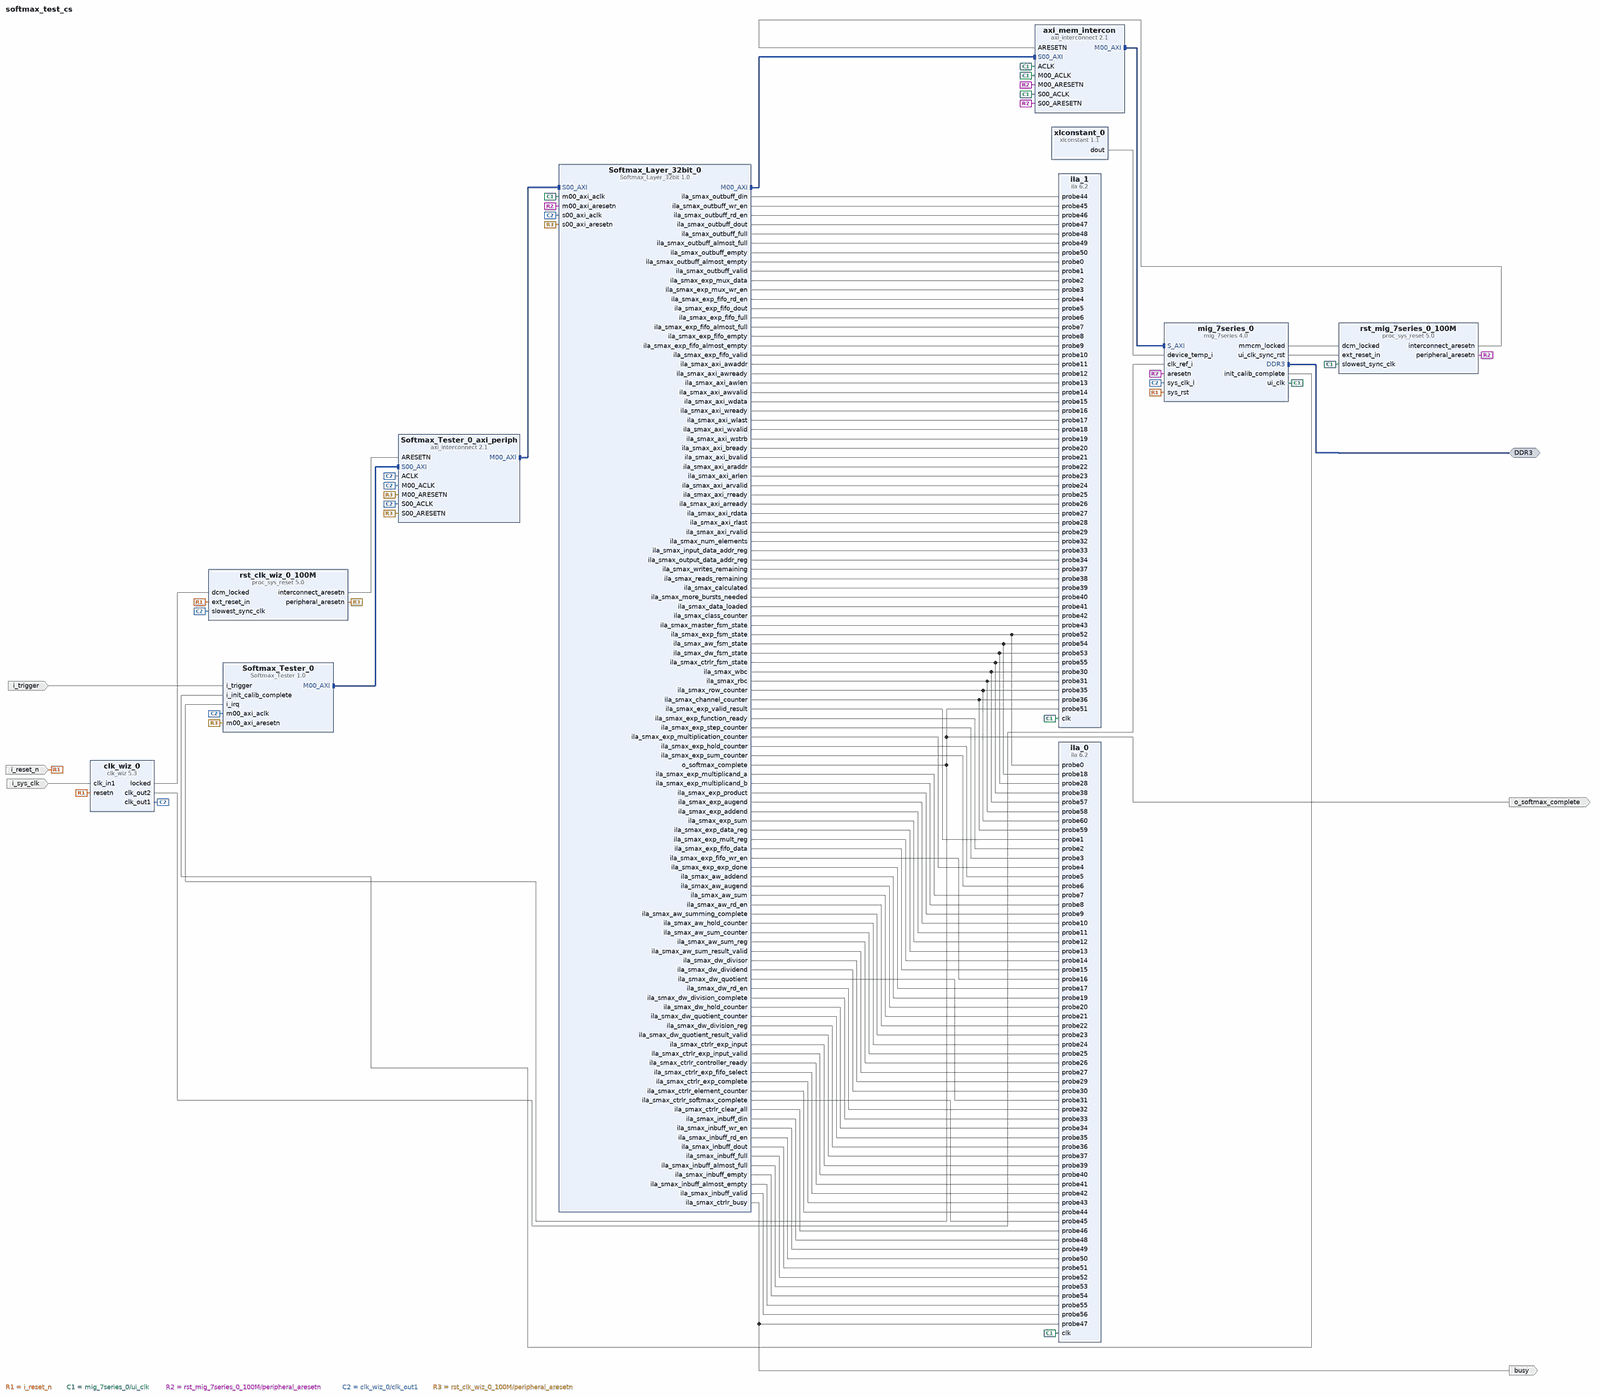
[diagram p0: block diagram of the top level, whole]
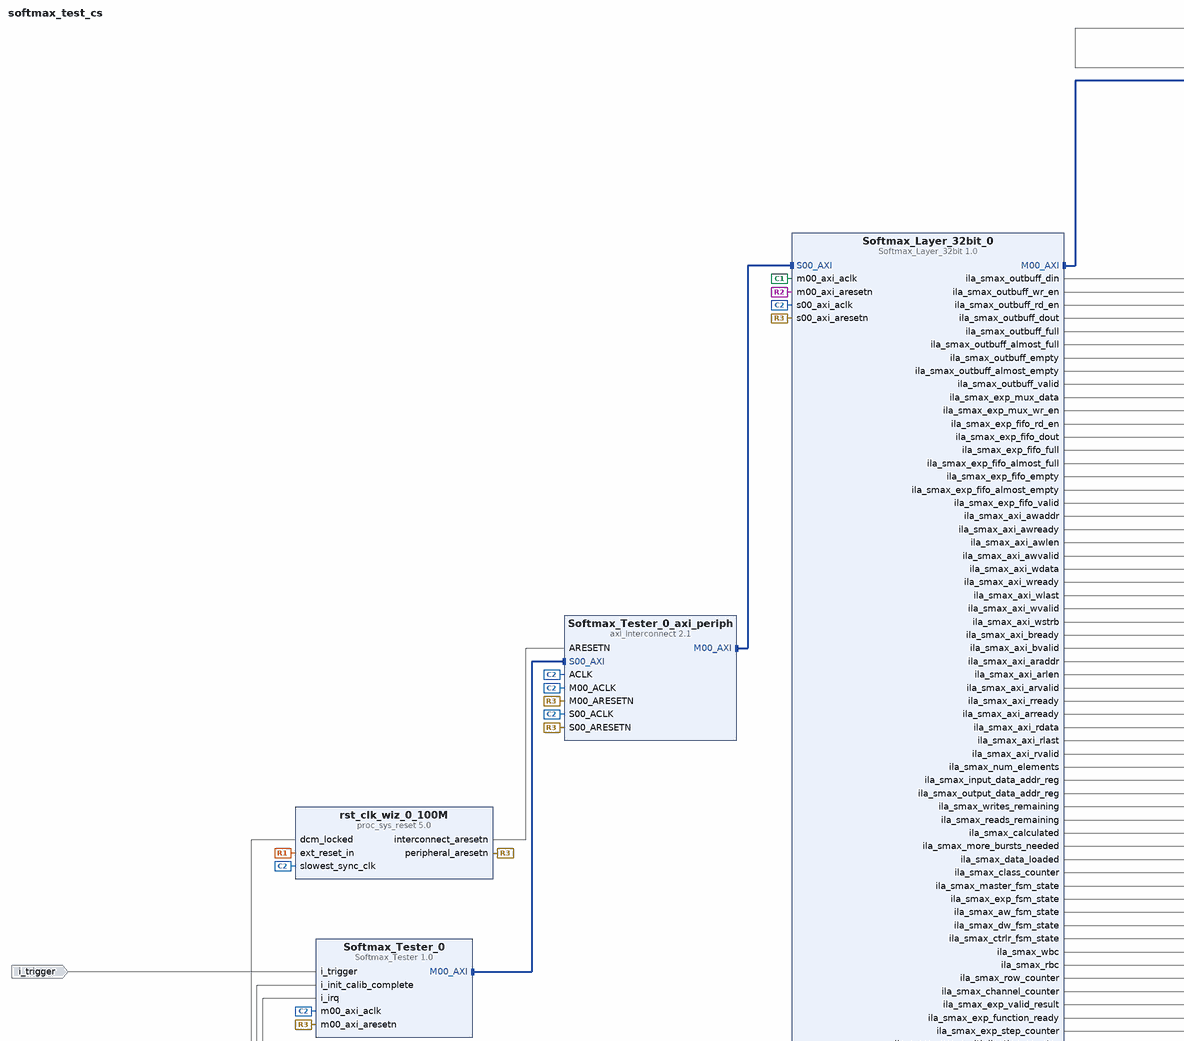
[diagram p1: block diagram of the top level, upper left part]
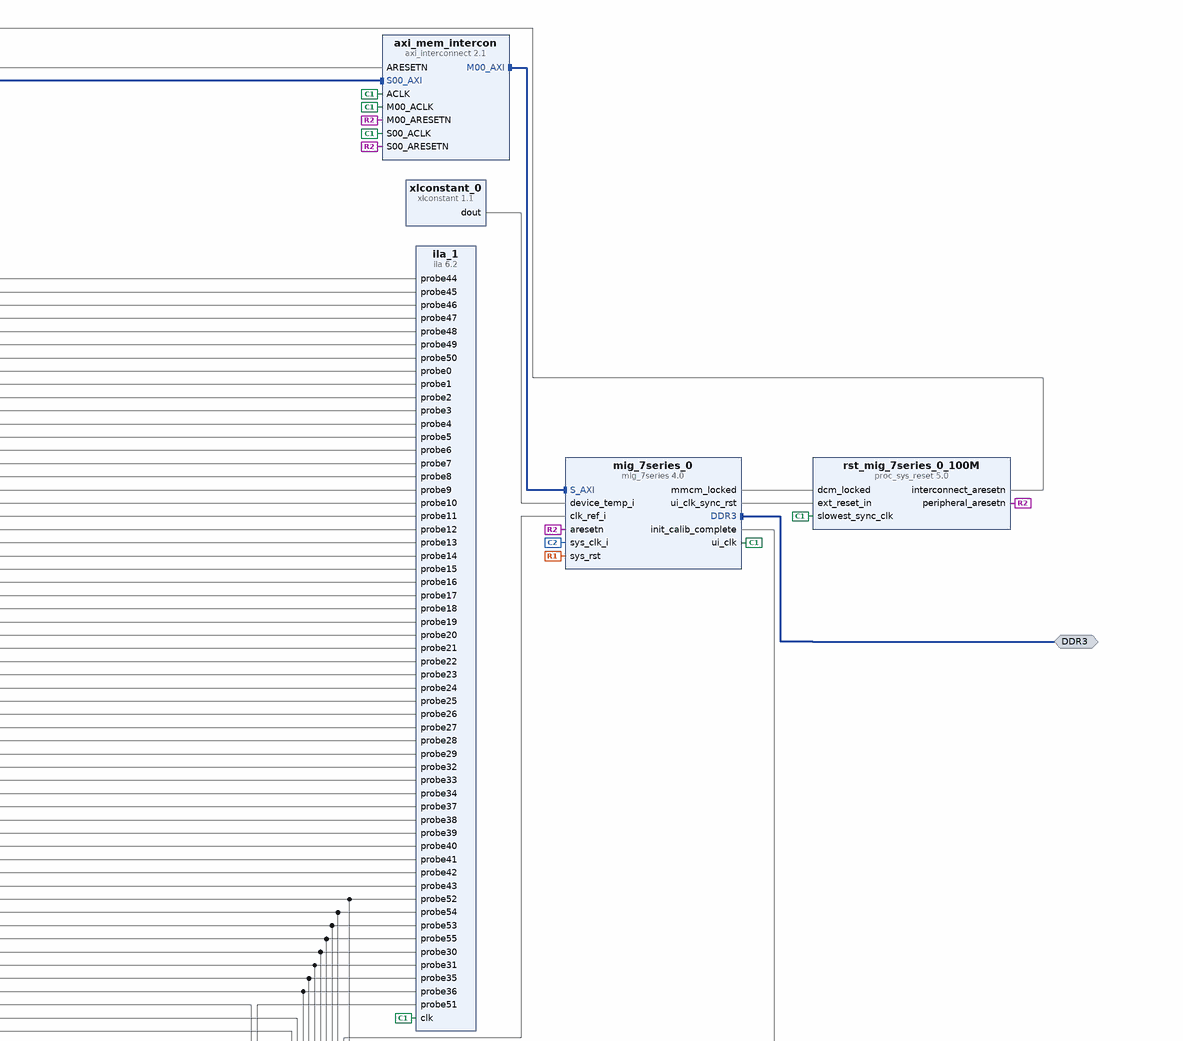
[diagram p2: block diagram of the top level, upper right part]
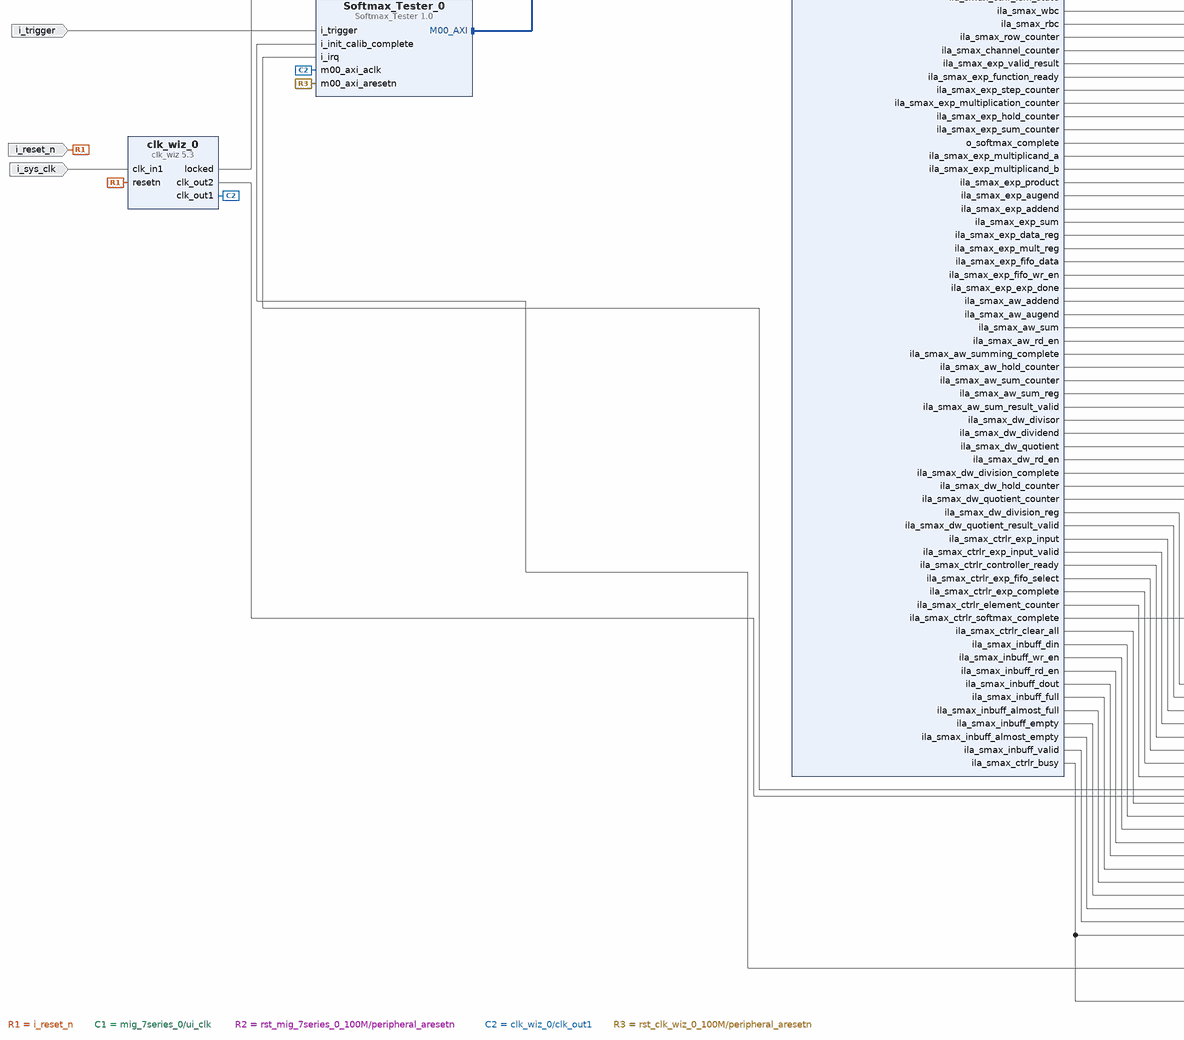
[diagram p3: block diagram of the top level, lower left part]
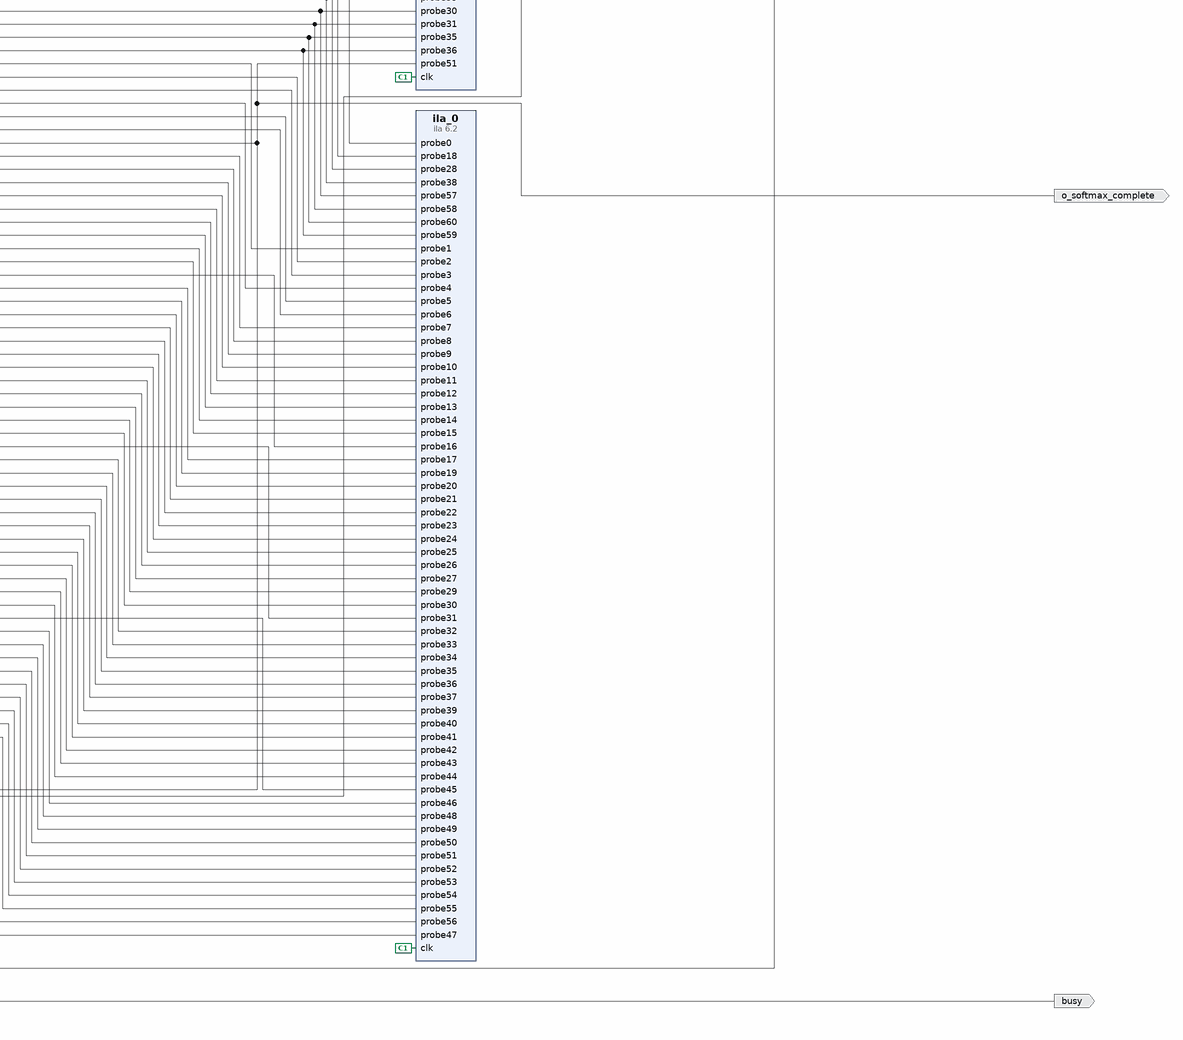
[diagram p4: block diagram of the top level, lower right part]
# Vivado block design softmax_test_cs, xc7a200tsbg484-1, Vivado 2016.4
create_bd_design softmax_test_cs

create_bd_intf_port -mode Master -vlnv xilinx.com:interface:ddrx_rtl:1.0 DDR3
create_bd_port -dir I -type clk i_sys_clk
create_bd_port -dir I -type rst i_reset_n
set_property -dict {CONFIG.POLARITY ACTIVE_LOW} [get_bd_ports i_reset_n]
create_bd_port -dir O o_softmax_complete
create_bd_port -dir I i_trigger
create_bd_port -dir O busy

create_bd_cell -type ip -vlnv xilinx.com:ip:mig_7series:4.0 mig_7series_0
set_property -dict [list \
  CONFIG.XML_INPUT_FILE mig_a.prj \
  CONFIG.RESET_BOARD_INTERFACE Custom \
  CONFIG.BOARD_MIG_PARAM Custom \
] [get_bd_cells mig_7series_0]
create_bd_cell -type ip -vlnv xilinx.com:ip:clk_wiz:5.3 clk_wiz_0
set_property -dict [list \
  CONFIG.CLKOUT2_USED true \
  CONFIG.NUM_OUT_CLKS 2 \
  CONFIG.CLKOUT2_REQUESTED_OUT_FREQ 200.000 \
  CONFIG.RESET_PORT resetn \
  CONFIG.MMCM_DIVCLK_DIVIDE 1 \
  CONFIG.MMCM_CLKOUT1_DIVIDE 5 \
  CONFIG.RESET_TYPE ACTIVE_LOW \
  CONFIG.CLKOUT2_JITTER 114.829 \
  CONFIG.CLKOUT2_PHASE_ERROR 98.575 \
] [get_bd_cells clk_wiz_0]
create_bd_cell -type ip -vlnv xilinx.com:ip:axi_interconnect:2.1 axi_mem_intercon
set_property -dict {CONFIG.NUM_MI 1} [get_bd_cells axi_mem_intercon]
create_bd_cell -type ip -vlnv xilinx.com:ip:proc_sys_reset:5.0 rst_mig_7series_0_100M
create_bd_cell -type ip -vlnv xilinx.com:ip:axi_interconnect:2.1 Softmax_Tester_0_axi_periph
set_property -dict {CONFIG.NUM_MI 1} [get_bd_cells Softmax_Tester_0_axi_periph]
create_bd_cell -type ip -vlnv xilinx.com:ip:proc_sys_reset:5.0 rst_clk_wiz_0_100M
create_bd_cell -type ip -vlnv xilinx.com:ip:xlconstant:1.1 xlconstant_0
set_property -dict {CONFIG.CONST_WIDTH 12} [get_bd_cells xlconstant_0]
create_bd_cell -type ip -vlnv xilinx.com:ip:ila:6.2 ila_0
set_property -dict [list \
  CONFIG.C_PROBE60_WIDTH 8 \
  CONFIG.C_PROBE59_WIDTH 16 \
  CONFIG.C_PROBE58_WIDTH 8 \
  CONFIG.C_PROBE57_WIDTH 8 \
  CONFIG.C_PROBE51_WIDTH 32 \
  CONFIG.C_PROBE48_WIDTH 32 \
  CONFIG.C_PROBE44_WIDTH 16 \
  CONFIG.C_PROBE39_WIDTH 32 \
  CONFIG.C_PROBE38_WIDTH 14 \
  CONFIG.C_PROBE36_WIDTH 32 \
  CONFIG.C_PROBE35_WIDTH 16 \
  CONFIG.C_PROBE34_WIDTH 8 \
  CONFIG.C_PROBE31_WIDTH 32 \
  CONFIG.C_PROBE30_WIDTH 32 \
  CONFIG.C_PROBE29_WIDTH 32 \
  CONFIG.C_PROBE28_WIDTH 4 \
  CONFIG.C_PROBE26_WIDTH 32 \
  CONFIG.C_PROBE25_WIDTH 16 \
  CONFIG.C_PROBE24_WIDTH 8 \
  CONFIG.C_PROBE21_WIDTH 32 \
  CONFIG.C_PROBE20_WIDTH 32 \
  CONFIG.C_PROBE19_WIDTH 32 \
  CONFIG.C_PROBE18_WIDTH 4 \
  CONFIG.C_PROBE15_WIDTH 32 \
  CONFIG.C_PROBE14_WIDTH 32 \
  CONFIG.C_PROBE13_WIDTH 32 \
  CONFIG.C_PROBE12_WIDTH 32 \
  CONFIG.C_PROBE11_WIDTH 32 \
  CONFIG.C_PROBE10_WIDTH 32 \
  CONFIG.C_PROBE9_WIDTH 32 \
  CONFIG.C_PROBE8_WIDTH 32 \
  CONFIG.C_PROBE7_WIDTH 32 \
  CONFIG.C_PROBE6_WIDTH 8 \
  CONFIG.C_PROBE5_WIDTH 8 \
  CONFIG.C_PROBE4_WIDTH 8 \
  CONFIG.C_PROBE3_WIDTH 8 \
  CONFIG.C_PROBE0_WIDTH 4 \
  CONFIG.C_NUM_OF_PROBES 61 \
  CONFIG.C_ENABLE_ILA_AXI_MON false \
  CONFIG.C_MONITOR_TYPE Native \
] [get_bd_cells ila_0]
create_bd_cell -type ip -vlnv xilinx.com:ip:ila:6.2 ila_1
set_property -dict [list \
  CONFIG.C_PROBE55_WIDTH 4 \
  CONFIG.C_PROBE54_WIDTH 4 \
  CONFIG.C_PROBE53_WIDTH 4 \
  CONFIG.C_PROBE52_WIDTH 4 \
  CONFIG.C_PROBE47_WIDTH 32 \
  CONFIG.C_PROBE44_WIDTH 32 \
  CONFIG.C_PROBE43_WIDTH 4 \
  CONFIG.C_PROBE42_WIDTH 32 \
  CONFIG.C_PROBE38_WIDTH 16 \
  CONFIG.C_PROBE37_WIDTH 16 \
  CONFIG.C_PROBE36_WIDTH 16 \
  CONFIG.C_PROBE35_WIDTH 8 \
  CONFIG.C_PROBE34_WIDTH 32 \
  CONFIG.C_PROBE33_WIDTH 32 \
  CONFIG.C_PROBE32_WIDTH 16 \
  CONFIG.C_PROBE31_WIDTH 8 \
  CONFIG.C_PROBE30_WIDTH 8 \
  CONFIG.C_PROBE27_WIDTH 32 \
  CONFIG.C_PROBE23_WIDTH 8 \
  CONFIG.C_PROBE22_WIDTH 32 \
  CONFIG.C_PROBE19_WIDTH 4 \
  CONFIG.C_PROBE15_WIDTH 32 \
  CONFIG.C_PROBE13_WIDTH 8 \
  CONFIG.C_PROBE11_WIDTH 32 \
  CONFIG.C_PROBE5_WIDTH 32 \
  CONFIG.C_PROBE2_WIDTH 32 \
  CONFIG.C_NUM_OF_PROBES 56 \
  CONFIG.C_ENABLE_ILA_AXI_MON false \
  CONFIG.C_MONITOR_TYPE Native \
] [get_bd_cells ila_1]
create_bd_cell -type ip -vlnv xilinx.com:user:Softmax_Tester:1.0 Softmax_Tester_0
create_bd_cell -type ip -vlnv xilinx.com:user:Softmax_Layer_32bit:1.0 Softmax_Layer_32bit_0

# ---- connections ----

connect_bd_intf_net [get_bd_intf_pins Softmax_Layer_32bit_0/M00_AXI] [get_bd_intf_pins axi_mem_intercon/S00_AXI]
connect_bd_intf_net [get_bd_intf_pins axi_mem_intercon/M00_AXI] [get_bd_intf_pins mig_7series_0/S_AXI]
connect_bd_intf_net [get_bd_intf_pins Softmax_Tester_0/M00_AXI] [get_bd_intf_pins Softmax_Tester_0_axi_periph/S00_AXI]
connect_bd_intf_net [get_bd_intf_pins Softmax_Tester_0_axi_periph/M00_AXI] [get_bd_intf_pins Softmax_Layer_32bit_0/S00_AXI]
connect_bd_intf_net [get_bd_intf_ports DDR3] [get_bd_intf_pins mig_7series_0/DDR3]
connect_bd_net -net clk_in1_1 [get_bd_ports i_sys_clk] [get_bd_pins clk_wiz_0/clk_in1]
connect_bd_net -net reset_1 [get_bd_ports i_reset_n] \
  [get_bd_pins rst_clk_wiz_0_100M/ext_reset_in] [get_bd_pins mig_7series_0/sys_rst] [get_bd_pins clk_wiz_0/resetn]
connect_bd_net [get_bd_pins mig_7series_0/ui_clk] \
  [get_bd_pins rst_mig_7series_0_100M/slowest_sync_clk] [get_bd_pins ila_0/clk] [get_bd_pins ila_1/clk] \
  [get_bd_pins axi_mem_intercon/S00_ACLK] [get_bd_pins axi_mem_intercon/ACLK] [get_bd_pins axi_mem_intercon/M00_ACLK] \
  [get_bd_pins Softmax_Layer_32bit_0/m00_axi_aclk]
connect_bd_net [get_bd_pins mig_7series_0/mmcm_locked] [get_bd_pins rst_mig_7series_0_100M/dcm_locked]
connect_bd_net [get_bd_pins mig_7series_0/ui_clk_sync_rst] [get_bd_pins rst_mig_7series_0_100M/ext_reset_in]
connect_bd_net [get_bd_pins rst_mig_7series_0_100M/peripheral_aresetn] \
  [get_bd_pins mig_7series_0/aresetn] [get_bd_pins axi_mem_intercon/S00_ARESETN] [get_bd_pins axi_mem_intercon/M00_ARESETN] \
  [get_bd_pins Softmax_Layer_32bit_0/m00_axi_aresetn]
connect_bd_net [get_bd_pins rst_mig_7series_0_100M/interconnect_aresetn] [get_bd_pins axi_mem_intercon/ARESETN]
connect_bd_net [get_bd_pins clk_wiz_0/clk_out1] \
  [get_bd_pins rst_clk_wiz_0_100M/slowest_sync_clk] [get_bd_pins mig_7series_0/sys_clk_i] \
  [get_bd_pins Softmax_Tester_0/m00_axi_aclk] [get_bd_pins Softmax_Tester_0_axi_periph/S00_ACLK] \
  [get_bd_pins Softmax_Tester_0_axi_periph/ACLK] [get_bd_pins Softmax_Tester_0_axi_periph/M00_ACLK] \
  [get_bd_pins Softmax_Layer_32bit_0/s00_axi_aclk]
connect_bd_net [get_bd_pins clk_wiz_0/locked] [get_bd_pins rst_clk_wiz_0_100M/dcm_locked]
connect_bd_net [get_bd_pins rst_clk_wiz_0_100M/peripheral_aresetn] \
  [get_bd_pins Softmax_Tester_0/m00_axi_aresetn] [get_bd_pins Softmax_Tester_0_axi_periph/S00_ARESETN] \
  [get_bd_pins Softmax_Tester_0_axi_periph/M00_ARESETN] [get_bd_pins Softmax_Layer_32bit_0/s00_axi_aresetn]
connect_bd_net [get_bd_pins rst_clk_wiz_0_100M/interconnect_aresetn] [get_bd_pins Softmax_Tester_0_axi_periph/ARESETN]
connect_bd_net [get_bd_pins mig_7series_0/init_calib_complete] [get_bd_pins Softmax_Tester_0/i_init_calib_complete]
connect_bd_net [get_bd_pins Softmax_Layer_32bit_0/o_softmax_complete] \
  [get_bd_ports o_softmax_complete] [get_bd_pins ila_1/probe51] [get_bd_pins Softmax_Tester_0/i_irq]
connect_bd_net [get_bd_pins xlconstant_0/dout] [get_bd_pins mig_7series_0/device_temp_i]
connect_bd_net [get_bd_pins clk_wiz_0/clk_out2] [get_bd_pins mig_7series_0/clk_ref_i]
connect_bd_net [get_bd_ports i_trigger] [get_bd_pins Softmax_Tester_0/i_trigger]
connect_bd_net [get_bd_pins Softmax_Layer_32bit_0/ila_smax_exp_fsm_state] [get_bd_pins ila_0/probe0] [get_bd_pins ila_1/probe52]
connect_bd_net [get_bd_pins Softmax_Layer_32bit_0/ila_smax_exp_valid_result] [get_bd_pins ila_0/probe1]
connect_bd_net [get_bd_pins Softmax_Layer_32bit_0/ila_smax_exp_function_ready] [get_bd_pins ila_0/probe2]
connect_bd_net [get_bd_pins Softmax_Layer_32bit_0/ila_smax_exp_step_counter] [get_bd_pins ila_0/probe3]
connect_bd_net [get_bd_pins Softmax_Layer_32bit_0/ila_smax_exp_multiplication_counter] [get_bd_pins ila_0/probe4]
connect_bd_net [get_bd_pins Softmax_Layer_32bit_0/ila_smax_exp_hold_counter] [get_bd_pins ila_0/probe5]
connect_bd_net [get_bd_pins Softmax_Layer_32bit_0/ila_smax_exp_sum_counter] [get_bd_pins ila_0/probe6]
connect_bd_net [get_bd_pins Softmax_Layer_32bit_0/ila_smax_exp_multiplicand_a] [get_bd_pins ila_0/probe7]
connect_bd_net [get_bd_pins Softmax_Layer_32bit_0/ila_smax_exp_multiplicand_b] [get_bd_pins ila_0/probe8]
connect_bd_net [get_bd_pins Softmax_Layer_32bit_0/ila_smax_exp_product] [get_bd_pins ila_0/probe9]
connect_bd_net [get_bd_pins Softmax_Layer_32bit_0/ila_smax_exp_augend] [get_bd_pins ila_0/probe10]
connect_bd_net [get_bd_pins Softmax_Layer_32bit_0/ila_smax_exp_addend] [get_bd_pins ila_0/probe11]
connect_bd_net [get_bd_pins Softmax_Layer_32bit_0/ila_smax_exp_sum] [get_bd_pins ila_0/probe12]
connect_bd_net [get_bd_pins Softmax_Layer_32bit_0/ila_smax_exp_data_reg] [get_bd_pins ila_0/probe13]
connect_bd_net [get_bd_pins Softmax_Layer_32bit_0/ila_smax_exp_mult_reg] [get_bd_pins ila_0/probe14]
connect_bd_net [get_bd_pins Softmax_Layer_32bit_0/ila_smax_exp_fifo_data] [get_bd_pins ila_0/probe15]
connect_bd_net [get_bd_pins Softmax_Layer_32bit_0/ila_smax_exp_fifo_wr_en] [get_bd_pins ila_0/probe16]
connect_bd_net [get_bd_pins Softmax_Layer_32bit_0/ila_smax_exp_exp_done] [get_bd_pins ila_0/probe17]
connect_bd_net [get_bd_pins Softmax_Layer_32bit_0/ila_smax_aw_fsm_state] [get_bd_pins ila_0/probe18] [get_bd_pins ila_1/probe54]
connect_bd_net [get_bd_pins Softmax_Layer_32bit_0/ila_smax_aw_addend] [get_bd_pins ila_0/probe19]
connect_bd_net [get_bd_pins Softmax_Layer_32bit_0/ila_smax_aw_augend] [get_bd_pins ila_0/probe20]
connect_bd_net [get_bd_pins Softmax_Layer_32bit_0/ila_smax_aw_sum] [get_bd_pins ila_0/probe21]
connect_bd_net [get_bd_pins Softmax_Layer_32bit_0/ila_smax_aw_rd_en] [get_bd_pins ila_0/probe22]
connect_bd_net [get_bd_pins Softmax_Layer_32bit_0/ila_smax_aw_summing_complete] [get_bd_pins ila_0/probe23]
connect_bd_net [get_bd_pins Softmax_Layer_32bit_0/ila_smax_aw_hold_counter] [get_bd_pins ila_0/probe24]
connect_bd_net [get_bd_pins Softmax_Layer_32bit_0/ila_smax_aw_sum_counter] [get_bd_pins ila_0/probe25]
connect_bd_net [get_bd_pins Softmax_Layer_32bit_0/ila_smax_aw_sum_reg] [get_bd_pins ila_0/probe26]
connect_bd_net [get_bd_pins Softmax_Layer_32bit_0/ila_smax_aw_sum_result_valid] [get_bd_pins ila_0/probe27]
connect_bd_net [get_bd_pins Softmax_Layer_32bit_0/ila_smax_dw_fsm_state] [get_bd_pins ila_0/probe28] [get_bd_pins ila_1/probe53]
connect_bd_net [get_bd_pins Softmax_Layer_32bit_0/ila_smax_dw_divisor] [get_bd_pins ila_0/probe29]
connect_bd_net [get_bd_pins Softmax_Layer_32bit_0/ila_smax_dw_dividend] [get_bd_pins ila_0/probe30]
connect_bd_net [get_bd_pins Softmax_Layer_32bit_0/ila_smax_dw_quotient] [get_bd_pins ila_0/probe31]
connect_bd_net [get_bd_pins Softmax_Layer_32bit_0/ila_smax_dw_rd_en] [get_bd_pins ila_0/probe32]
connect_bd_net [get_bd_pins Softmax_Layer_32bit_0/ila_smax_dw_division_complete] [get_bd_pins ila_0/probe33]
connect_bd_net [get_bd_pins Softmax_Layer_32bit_0/ila_smax_dw_hold_counter] [get_bd_pins ila_0/probe34]
connect_bd_net [get_bd_pins Softmax_Layer_32bit_0/ila_smax_dw_quotient_counter] [get_bd_pins ila_0/probe35]
connect_bd_net [get_bd_pins Softmax_Layer_32bit_0/ila_smax_dw_division_reg] [get_bd_pins ila_0/probe36]
connect_bd_net [get_bd_pins Softmax_Layer_32bit_0/ila_smax_dw_quotient_result_valid] [get_bd_pins ila_0/probe37]
connect_bd_net [get_bd_pins Softmax_Layer_32bit_0/ila_smax_ctrlr_fsm_state] [get_bd_pins ila_0/probe38] [get_bd_pins ila_1/probe55]
connect_bd_net [get_bd_pins Softmax_Layer_32bit_0/ila_smax_ctrlr_exp_input] [get_bd_pins ila_0/probe39]
connect_bd_net [get_bd_pins Softmax_Layer_32bit_0/ila_smax_ctrlr_exp_input_valid] [get_bd_pins ila_0/probe40]
connect_bd_net [get_bd_pins Softmax_Layer_32bit_0/ila_smax_ctrlr_controller_ready] [get_bd_pins ila_0/probe41]
connect_bd_net [get_bd_pins Softmax_Layer_32bit_0/ila_smax_ctrlr_exp_fifo_select] [get_bd_pins ila_0/probe42]
connect_bd_net [get_bd_pins Softmax_Layer_32bit_0/ila_smax_ctrlr_exp_complete] [get_bd_pins ila_0/probe43]
connect_bd_net [get_bd_pins Softmax_Layer_32bit_0/ila_smax_ctrlr_element_counter] [get_bd_pins ila_0/probe44]
connect_bd_net [get_bd_pins Softmax_Layer_32bit_0/ila_smax_ctrlr_softmax_complete] [get_bd_pins ila_0/probe45]
connect_bd_net [get_bd_pins Softmax_Layer_32bit_0/ila_smax_ctrlr_clear_all] [get_bd_pins ila_0/probe46]
connect_bd_net [get_bd_pins Softmax_Layer_32bit_0/ila_smax_ctrlr_busy] [get_bd_ports busy] [get_bd_pins ila_0/probe47]
connect_bd_net [get_bd_pins Softmax_Layer_32bit_0/ila_smax_inbuff_din] [get_bd_pins ila_0/probe48]
connect_bd_net [get_bd_pins Softmax_Layer_32bit_0/ila_smax_inbuff_wr_en] [get_bd_pins ila_0/probe49]
connect_bd_net [get_bd_pins Softmax_Layer_32bit_0/ila_smax_inbuff_rd_en] [get_bd_pins ila_0/probe50]
connect_bd_net [get_bd_pins Softmax_Layer_32bit_0/ila_smax_inbuff_dout] [get_bd_pins ila_0/probe51]
connect_bd_net [get_bd_pins Softmax_Layer_32bit_0/ila_smax_inbuff_full] [get_bd_pins ila_0/probe52]
connect_bd_net [get_bd_pins Softmax_Layer_32bit_0/ila_smax_inbuff_almost_full] [get_bd_pins ila_0/probe53]
connect_bd_net [get_bd_pins Softmax_Layer_32bit_0/ila_smax_inbuff_empty] [get_bd_pins ila_0/probe54]
connect_bd_net [get_bd_pins Softmax_Layer_32bit_0/ila_smax_inbuff_almost_empty] [get_bd_pins ila_0/probe55]
connect_bd_net [get_bd_pins Softmax_Layer_32bit_0/ila_smax_inbuff_valid] [get_bd_pins ila_0/probe56]
connect_bd_net [get_bd_pins Softmax_Layer_32bit_0/ila_smax_outbuff_din] [get_bd_pins ila_1/probe44]
connect_bd_net [get_bd_pins Softmax_Layer_32bit_0/ila_smax_outbuff_wr_en] [get_bd_pins ila_1/probe45]
connect_bd_net [get_bd_pins Softmax_Layer_32bit_0/ila_smax_outbuff_rd_en] [get_bd_pins ila_1/probe46]
connect_bd_net [get_bd_pins Softmax_Layer_32bit_0/ila_smax_outbuff_dout] [get_bd_pins ila_1/probe47]
connect_bd_net [get_bd_pins Softmax_Layer_32bit_0/ila_smax_outbuff_full] [get_bd_pins ila_1/probe48]
connect_bd_net [get_bd_pins Softmax_Layer_32bit_0/ila_smax_outbuff_almost_full] [get_bd_pins ila_1/probe49]
connect_bd_net [get_bd_pins Softmax_Layer_32bit_0/ila_smax_outbuff_empty] [get_bd_pins ila_1/probe50]
connect_bd_net [get_bd_pins Softmax_Layer_32bit_0/ila_smax_outbuff_almost_empty] [get_bd_pins ila_1/probe0]
connect_bd_net [get_bd_pins Softmax_Layer_32bit_0/ila_smax_outbuff_valid] [get_bd_pins ila_1/probe1]
connect_bd_net [get_bd_pins Softmax_Layer_32bit_0/ila_smax_exp_mux_data] [get_bd_pins ila_1/probe2]
connect_bd_net [get_bd_pins Softmax_Layer_32bit_0/ila_smax_exp_mux_wr_en] [get_bd_pins ila_1/probe3]
connect_bd_net [get_bd_pins Softmax_Layer_32bit_0/ila_smax_exp_fifo_rd_en] [get_bd_pins ila_1/probe4]
connect_bd_net [get_bd_pins Softmax_Layer_32bit_0/ila_smax_exp_fifo_dout] [get_bd_pins ila_1/probe5]
connect_bd_net [get_bd_pins Softmax_Layer_32bit_0/ila_smax_exp_fifo_full] [get_bd_pins ila_1/probe6]
connect_bd_net [get_bd_pins Softmax_Layer_32bit_0/ila_smax_exp_fifo_almost_full] [get_bd_pins ila_1/probe7]
connect_bd_net [get_bd_pins Softmax_Layer_32bit_0/ila_smax_exp_fifo_empty] [get_bd_pins ila_1/probe8]
connect_bd_net [get_bd_pins Softmax_Layer_32bit_0/ila_smax_exp_fifo_almost_empty] [get_bd_pins ila_1/probe9]
connect_bd_net [get_bd_pins Softmax_Layer_32bit_0/ila_smax_exp_fifo_valid] [get_bd_pins ila_1/probe10]
connect_bd_net [get_bd_pins Softmax_Layer_32bit_0/ila_smax_axi_awaddr] [get_bd_pins ila_1/probe11]
connect_bd_net [get_bd_pins Softmax_Layer_32bit_0/ila_smax_axi_awready] [get_bd_pins ila_1/probe12]
connect_bd_net [get_bd_pins Softmax_Layer_32bit_0/ila_smax_axi_awlen] [get_bd_pins ila_1/probe13]
connect_bd_net [get_bd_pins Softmax_Layer_32bit_0/ila_smax_axi_awvalid] [get_bd_pins ila_1/probe14]
connect_bd_net [get_bd_pins Softmax_Layer_32bit_0/ila_smax_axi_wdata] [get_bd_pins ila_1/probe15]
connect_bd_net [get_bd_pins Softmax_Layer_32bit_0/ila_smax_axi_wready] [get_bd_pins ila_1/probe16]
connect_bd_net [get_bd_pins Softmax_Layer_32bit_0/ila_smax_axi_wlast] [get_bd_pins ila_1/probe17]
connect_bd_net [get_bd_pins Softmax_Layer_32bit_0/ila_smax_axi_wvalid] [get_bd_pins ila_1/probe18]
connect_bd_net [get_bd_pins Softmax_Layer_32bit_0/ila_smax_axi_wstrb] [get_bd_pins ila_1/probe19]
connect_bd_net [get_bd_pins Softmax_Layer_32bit_0/ila_smax_axi_bready] [get_bd_pins ila_1/probe20]
connect_bd_net [get_bd_pins Softmax_Layer_32bit_0/ila_smax_axi_bvalid] [get_bd_pins ila_1/probe21]
connect_bd_net [get_bd_pins Softmax_Layer_32bit_0/ila_smax_axi_araddr] [get_bd_pins ila_1/probe22]
connect_bd_net [get_bd_pins Softmax_Layer_32bit_0/ila_smax_axi_arlen] [get_bd_pins ila_1/probe23]
connect_bd_net [get_bd_pins Softmax_Layer_32bit_0/ila_smax_axi_arvalid] [get_bd_pins ila_1/probe24]
connect_bd_net [get_bd_pins Softmax_Layer_32bit_0/ila_smax_axi_rready] [get_bd_pins ila_1/probe25]
connect_bd_net [get_bd_pins Softmax_Layer_32bit_0/ila_smax_axi_arready] [get_bd_pins ila_1/probe26]
connect_bd_net [get_bd_pins Softmax_Layer_32bit_0/ila_smax_axi_rdata] [get_bd_pins ila_1/probe27]
connect_bd_net [get_bd_pins Softmax_Layer_32bit_0/ila_smax_axi_rlast] [get_bd_pins ila_1/probe28]
connect_bd_net [get_bd_pins Softmax_Layer_32bit_0/ila_smax_axi_rvalid] [get_bd_pins ila_1/probe29]
connect_bd_net [get_bd_pins Softmax_Layer_32bit_0/ila_smax_wbc] [get_bd_pins ila_1/probe30] [get_bd_pins ila_0/probe57]
connect_bd_net [get_bd_pins Softmax_Layer_32bit_0/ila_smax_rbc] [get_bd_pins ila_1/probe31] [get_bd_pins ila_0/probe58]
connect_bd_net [get_bd_pins Softmax_Layer_32bit_0/ila_smax_num_elements] [get_bd_pins ila_1/probe32]
connect_bd_net [get_bd_pins Softmax_Layer_32bit_0/ila_smax_input_data_addr_reg] [get_bd_pins ila_1/probe33]
connect_bd_net [get_bd_pins Softmax_Layer_32bit_0/ila_smax_output_data_addr_reg] [get_bd_pins ila_1/probe34]
connect_bd_net [get_bd_pins Softmax_Layer_32bit_0/ila_smax_row_counter] [get_bd_pins ila_1/probe35] [get_bd_pins ila_0/probe60]
connect_bd_net [get_bd_pins Softmax_Layer_32bit_0/ila_smax_channel_counter] [get_bd_pins ila_1/probe36] [get_bd_pins ila_0/probe59]
connect_bd_net [get_bd_pins Softmax_Layer_32bit_0/ila_smax_writes_remaining] [get_bd_pins ila_1/probe37]
connect_bd_net [get_bd_pins Softmax_Layer_32bit_0/ila_smax_reads_remaining] [get_bd_pins ila_1/probe38]
connect_bd_net [get_bd_pins Softmax_Layer_32bit_0/ila_smax_calculated] [get_bd_pins ila_1/probe39]
connect_bd_net [get_bd_pins Softmax_Layer_32bit_0/ila_smax_more_bursts_needed] [get_bd_pins ila_1/probe40]
connect_bd_net [get_bd_pins Softmax_Layer_32bit_0/ila_smax_data_loaded] [get_bd_pins ila_1/probe41]
connect_bd_net [get_bd_pins Softmax_Layer_32bit_0/ila_smax_class_counter] [get_bd_pins ila_1/probe42]
connect_bd_net [get_bd_pins Softmax_Layer_32bit_0/ila_smax_master_fsm_state] [get_bd_pins ila_1/probe43]

# ---- address map ----
assign_bd_address -offset 0x80000000 -range 512M -target_address_space [get_bd_addr_spaces Softmax_Layer_32bit_0/M00_AXI] [get_bd_addr_segs mig_7series_0/memmap/memaddr]
assign_bd_address -offset 0x44A00000 -range 64K -target_address_space [get_bd_addr_spaces Softmax_Tester_0/M00_AXI] [get_bd_addr_segs Softmax_Layer_32bit_0/S00_AXI/S00_AXI_reg]

validate_bd_design
save_bd_design
